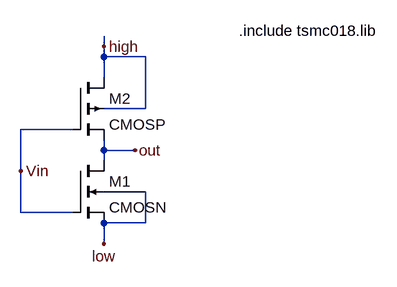
[diagram p0: schematic Inverter.asc]
Inverter.asc, the LTspice schematic file:
Version 4
SHEET 1 880 680
WIRE 192 -16 192 -32
WIRE 192 0 192 -16
WIRE 256 0 192 0
WIRE 192 32 192 0
WIRE 256 80 256 0
WIRE 256 80 192 80
WIRE 144 112 64 112
WIRE 192 144 192 128
WIRE 240 144 192 144
WIRE 192 160 192 144
WIRE 64 176 64 112
WIRE 256 208 192 208
WIRE 64 240 64 176
WIRE 144 240 64 240
WIRE 256 256 256 208
WIRE 256 256 192 256
WIRE 192 288 192 256
FLAG 64 176 Vin
FLAG 192 -16 high
FLAG 192 288 low
FLAG 240 144 out
SYMBOL cmosn 144 160 R0
SYMATTR InstName M1
SYMATTR Value2 l=180n w=1u
SYMBOL cmosp 144 32 R0
SYMATTR InstName M2
SYMATTR Value2 l=180n w=1200n
TEXT 400 -40 Left 2 !.include tsmc018.lib

The netlist it stands for:
* Inverter.asc
M1 out Vin low low CMOSN l=180n w=1u
M2 high Vin out high CMOSP l=180n w=1200n
.model NMOS NMOS
.model PMOS PMOS
.lib standard.mos
.include tsmc018.lib
.backanno
.end